# EAGLE design HASP_relay_V.2 (EAGLE 7.6.0)
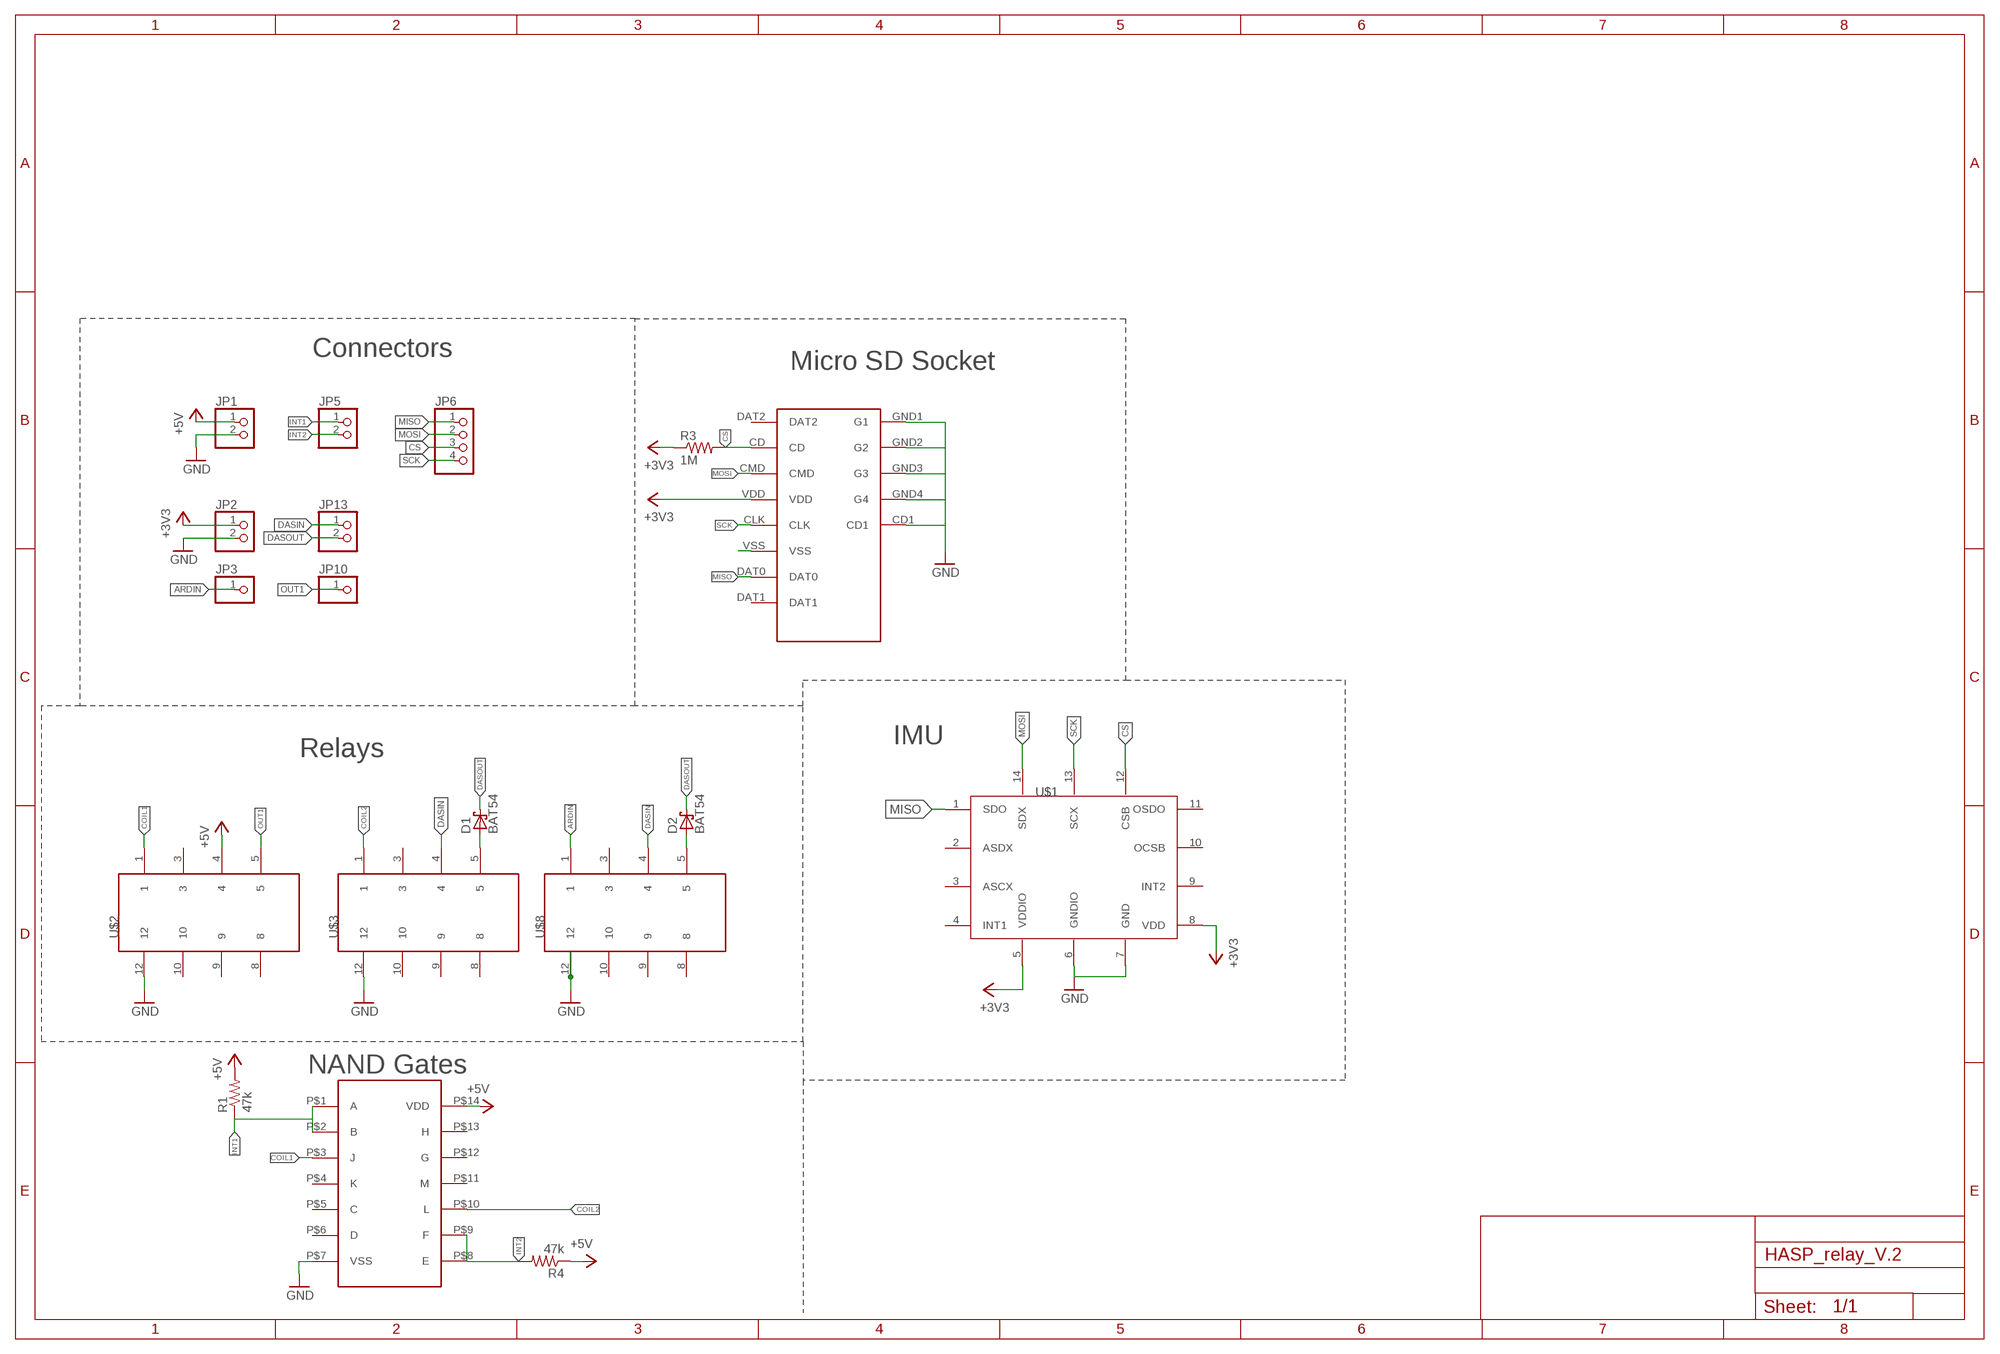
[diagram p0: schematic, sheet 1]

## Parts
D1  BAT54  [SOT23]
D2  BAT54  [SOT23]
JP1  PINHD-1X2  [1X02]
JP2  PINHD-1X2  [1X02]
JP3  PINHD-1X1  [1X01]
JP5  PINHD-1X2  [1X02]
JP6  PINHD-1X4  [1X04]
JP10  PINHD-1X1  [1X01]
JP13  PINHD-1X2  [1X02]
R1  47k  CRGS0603J1K5  [RESC1608X50N]
R3  1M  R-US_R0603  [R0603]
R4  47k  CRGS0603J1K5  [RESC1608X50N]
U$1  BMI160  [IMU]
U$2  EC2  [EC2-5SNU]
U$3  EC2  [EC2-5SNU]
U$4  MICRO_SD  [MICRO_SD_HINGED]
U$5  CD4093BE  [CD4093BE]
U$8  EC2  [EC2-5SNU]

## Nets
+3V3: JP2.1 R3.1 U$1.5(VDDIO) U$1.8(VDD) U$4.VDD
+5V: JP1.1 R1.2 R4.1 U$2.4 U$5.P$14(VDD)
ARDIN: JP3.1 U$8.1
COIL1: U$2.1 U$5.P$3(J)
COIL2: U$3.1 U$5.P$10(L)
CS: JP6.3 R3.2 U$1.12(CSB) U$4.CD
DASIN: JP13.1 U$3.4 U$8.4
DASOUT: D1.3(K) D2.3(K) JP13.2
GND: JP1.2 JP2.2 U$1.6(GNDIO) U$1.7(GND) U$2.12 U$3.12 U$4.CD1 U$4.GND1(G1) U$4.GND2(G2) U$4.GND3(G3) U$4.GND4(G4) U$5.P$7(VSS) U$8.12
INT1: JP5.1 U$5.P$1(A) U$5.P$2(B)
INT2: JP5.2 R4.2 U$5.P$8(E) U$5.P$9(F)
MISO: JP6.1 U$1.1(SDO) U$4.DAT0
MOSI: JP6.2 U$1.14(SDX) U$4.CMD
N$2: R1.1
N$3: D1.1(A) U$3.5
N$4: D2.1(A) U$8.5
N$5: U$4.VSS
OUT1: JP10.1 U$2.5
SCK: JP6.4 U$1.13(SCX) U$4.CLK
Unconnected: U$1.2(ASDX) U$1.3(ASCX) U$1.4(INT1) U$1.9(INT2) U$1.10(OCSB) U$1.11(OSDO) U$2.3 U$2.8 U$2.9 U$2.10 U$3.3 U$3.8 U$3.9 U$3.10 U$4.DAT1 U$4.DAT2 U$5.P$4(K) U$5.P$5(C) U$5.P$6(D) U$5.P$11(M) U$5.P$12(G) U$5.P$13(H) U$8.3 U$8.8 U$8.9 U$8.10

## Notes on the sheet
- Connectors
- Micro SD Socket
- IMU
- Relays
- NAND Gates

## Library data of the parts
D1 D2 = BAT54:BAT54: Schottky barrier diode Planar Schottky barrier diode encapsulated in small plastic SMD packages. Single diodes and double diodes with different pinning are available AAL Eindhoven MK; AVAILABILITY: Good; DESCRIPTION: Small Signal Schottky Diode, Single, 30 V, 200 mA, 800 mV, 600 mA, 150 C; MF: ON Semiconductor; MP: BAT54; PACKAGE: SOT-23-3 ON Semiconductor; PRICE: 0.08 USD
JP1 JP2 JP5 JP13 = pinhead:PINHD-1X2: PIN HEADER
JP3 JP10 = pinhead:PINHD-1X1: PIN HEADER
JP6 = pinhead:PINHD-1X4: PIN HEADER
R1 R4 = CRGS0603J1K5:CRGS0603J1K5: RESISTOR, THICK FILM, 1K5, 5%, 0603; AVAILABILITY: Good; DESCRIPTION: Resistor, Thick Film, 1k5, 5%, 0603; MF: TE Connectivity; MP: CRGS0603J1K5; PACKAGE: 0603 TE Connectivity / AMP; PRICE: 0.05 USD
R3 = resistor:R-US_: RESISTOR, American symbol
U$1 = IMU:BMI160
U$2 U$3 U$8 = relay board:EC2: EC2 is miniature signal relay Minimal board space is consumed with either a through-hole or surface mount configuration. Datasheet https://content.kemet.com/datasheets/KEM_R7002_EC2_EE2.pdf
U$4 = NR_connectors:MICRO_SD
U$5 = NAND Gates:CD4093BE: 4-Channel 2-Input 14-pin NAND Gates Datasheet: http://www.ti.com/lit/ds/symlink/cd4093b.pdf

## Board
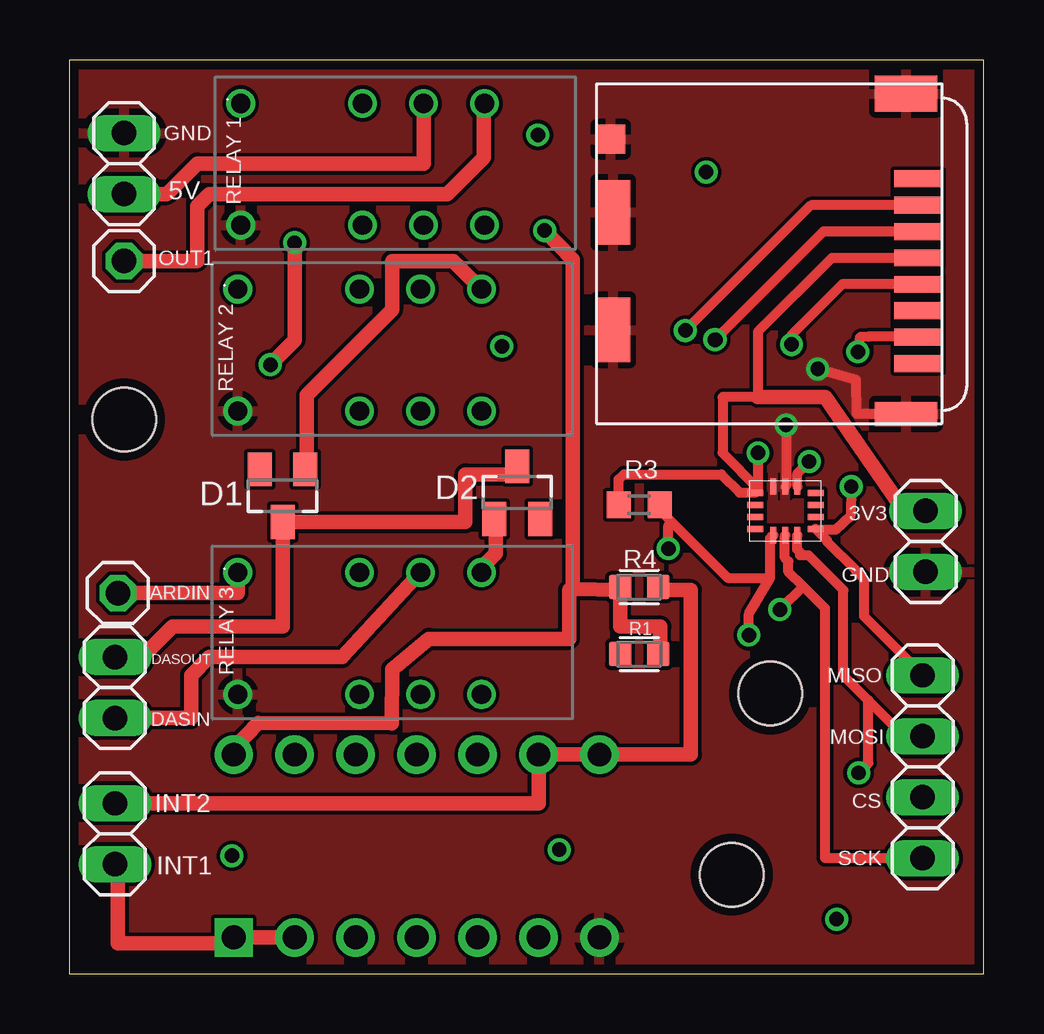
[diagram p1: board, top side]
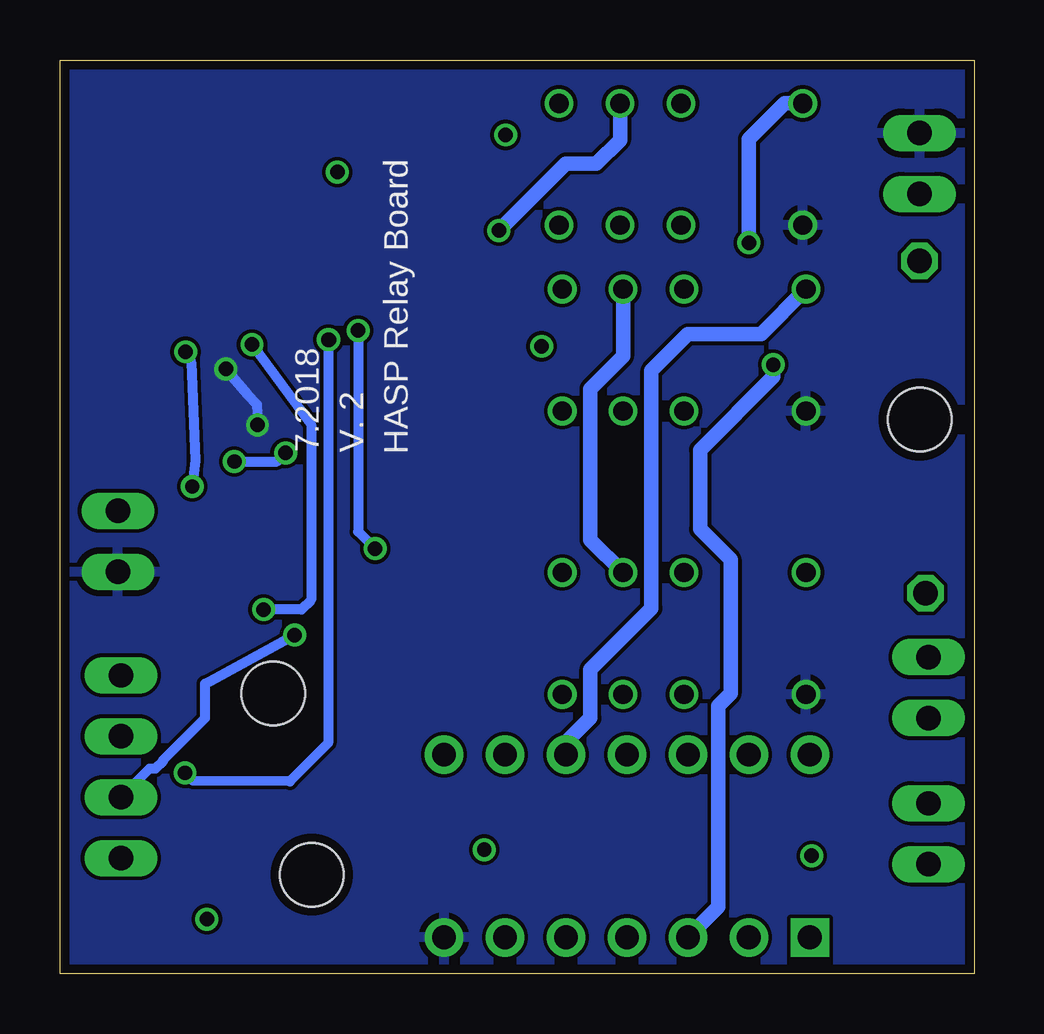
[diagram p2: board, bottom side, seen from below]

Size 38.1 x 38.1 mm. Coordinates in mm from the lower left corner, seen from the top.
Outline: 0,0 38.1,0 38.1,38.1 0,38.1 0,0
Copper layers (1*16): Top 0.0356mm / dielectric 1.5011mm / Bottom 0.0356mm
Design rules "OshPark": minimum track width 6mil, minimum drill 13mil, track to track 6mil, track to pad 6mil, pad to pad 6mil, via to via 6mil, smd to smd 6mil, copper to edge 15mil, drill to drill 6mil, minimum pad ring 7mil, minimum via ring 7mil, stop-mask expansion 3mil, vias tented up to drill 0mil, thermal gap 10mil
Holes 2.65 mm at 2.29,23.11 29.21,11.68 27.61,4.14

### Footprints (pad centres in the part's own frame; a part is rotated, then mirrored left to right if it is on the bottom)
SOT23 = smd 1 x 1.4: 1 -0.95,-1.1; 2 0.95,-1.1; 3 0,1.1
1X02 = drill 1.016 long: 1 -1.27,0; 2 1.27,0
1X01 = drill 1.016 octagon: 1 0,0
1X04 = drill 1.016 long: 1 -3.81,0; 2 -1.27,0; 3 1.27,0; 4 3.81,0
RESC1608X50N = smd 0.94 x 1.02: 1 -0.79,0; 2 0.79,0
R0603 = smd 1 x 1.1: 1 -0.85,0; 2 0.85,0
IMU = smd 0.675 x 0.25: 1 -1.262,0.75; 2 -1.262,0.25; 3 -1.262,-0.25; 4 -1.262,-0.75; 8 1.262,-0.75; 9 1.262,-0.25; 10 1.262,0.25; 11 1.262,0.75 | smd 0.25 x 0.675: 5 -0.5,-1.012; 6 0,-1.012; 7 0.5,-1.012; 12 0.5,1.012; 13 0,1.012; 14 -0.5,1.012
EC2-5SNU = drill 0.8: 1 1.05,6.19; 3 6.13,6.19; 4 8.67,6.19; 5 11.21,6.19; 8 11.21,1.11; 9 8.67,1.11; 10 6.13,1.11; 12 1.05,1.11
MICRO_SD_HINGED = smd 0.7 x 2: CD -1.1,-13.4; CLK -4.4,-13.4; CMD -2.2,-13.4; DAT0 -6.6,-13.4; DAT1 -7.7,-13.4; DAT2 0,-13.4; VDD -3.3,-13.4; VSS -5.5,-13.4 | smd 2.7 x 1.4: CD1 -1.4,-0.7; GND3 -6.3,-0.7 | smd 1.5 x 2.6: GND1 3.55,-12.9 | smd 1.2 x 1.2: GND2 1.65,-0.6 | smd 1 x 2.6: GND4 -9.8,-12.9
CD4093BE = drill 0.991 pad 1.6 square: P$1 -3.81,7.62 | drill 0.991 pad 1.6: P$2 -3.81,5.08; P$3 -3.81,2.54; P$4 -3.81,0; P$5 -3.81,-2.54; P$6 -3.81,-5.08; P$7 -3.81,-7.62; P$8 3.81,-7.62; P$9 3.81,-5.08; P$10 3.81,-2.54; P$11 3.81,0; P$12 3.81,2.54; P$13 3.81,5.08; P$14 3.81,7.62

### Placement (x,y rotation side)
D1  8.89,19.94 180 top
D2  18.67,20.07 0 top
JP1  2.29,33.78 90 top
JP2  35.69,18.03 270 top
JP3  2.03,15.88 0 top
JP5  1.91,5.84 90 top
JP6  35.56,8.64 270 top
JP10  2.29,29.72 0 top
JP13  1.91,11.94 90 top
R1  23.75,13.34 0 top
R3  23.75,19.56 0 top
R4  23.75,16.13 0 top
U$1  29.84,19.3 180 top
U$2  6.1,30.1 0 top
U$3  5.97,22.35 0 top
U$4  21.97,33.15 90 top
U$5  14.48,5.33 90 top
U$8  5.97,10.54 0 top

### Tracks (layer width: path | path; a pad name or v marks a point on that pad's centre or on a via)
+3V3  (via drill 0.6)
  Top 0.406: R3.1 22.9,20.61 23.11,20.83 27.18,20.83 27.94,20.07 28.57,20.07 U$1.8 28.7,20.17 28.7,20.24 | 28.7,20.24 27.23,21.72 27.23,24.03 27.25,24.05 28.7,24.05 28.7,26.77 31.77,29.84 U$4.VDD | U$1.5 30.34,20.87 v30.84,21.36 | v28.7,21.72 28.7,20.24
  Top 0.61: JP2.1 34.8,19.3 31.5,24.05 28.7,24.05
  Bottom 0.406: v30.84,21.36 29.06,21.36 v28.7,21.72
+5V  (via drill 0.6)
  Top 0.61: R1.2 24.64,13.34 24.64,14.48 22.96,14.48 R4.1 22.96,16 20.98,16.05 | JP1.1 4.06,32.51 5.33,33.78 14.77,33.78 U$2.4 | U$5.P$14 6.86,9.4 7.87,10.46 13.44,10.44 13.46,12.7 14.99,13.97 20.83,13.97 20.83,16 20.98,16.05 | v19.81,30.99 20.98,29.77 20.98,16.05
  Bottom 0.61: U$2.4 14.77,34.76 15.75,33.78 17.02,33.78 v19.81,30.99
ARDIN
  Top 0.61: JP3.1 7.02,15.88 U$8.1
COIL1  (via drill 0.6)
  Top 0.61: v9.4,30.48 9.4,26.42 v8.38,25.4
  Bottom 0.61: U$2.1 7.91,36.29 9.4,34.8 v9.4,30.48 | v8.38,25.4 8.38,24.89 11.43,21.84 11.43,18.54 10.16,17.27 10.16,11.68 10.67,11.18 10.67,2.79 U$5.P$3
COIL2
  Bottom 0.61: U$5.P$10 17.02,9.65 16,10.67 16,12.7 13.46,15.24 13.46,25.15 11.94,26.67 8.89,26.67 U$3.1
CS  (via drill 0.6)
  Top 0.406: R3.2 24.6,19.34 25.11,18.83 | 25.11,18.83 27.43,16.51 29.21,16.51 | 29.21,16.51 29.21,18.16 U$1.12 | U$4.CD 30.9,32.05 v25.68,26.82 | v24.97,17.73 24.97,18.69 25.11,18.83 | v28.32,14.12 28.32,15.01 29.21,16.51
  Bottom 0.406: v25.68,26.82 25.68,18.44 v24.97,17.73 | JP6.3 34.37,8.56 34.11,8.56 33.81,8.87 33.81,8.91 32.05,10.67 32.05,12.09 v28.32,14.12
DASIN
  Top 0.61: JP13.1 5.08,10.67 5.08,12.45 5.84,13.21 11.37,13.21 U$8.4
  Bottom 0.61: U$3.4 14.64,25.75 16,24.38 16,18.09 U$8.4
DASOUT
  Top 0.61: JP13.2 3.05,13.21 4.32,14.48 8.89,14.48 D1.3 16.51,18.84 16.51,20.83 18.67,20.83 D2.3
GND  (via drill 0.6)
  Top 0.406: U$4.GND4 32.81,23.35 32.79,24.77 v31.19,25.22 | v29.87,22.89 29.87,20.34 U$1.6
  Bottom 0.406: v31.19,25.22 30.3,24.18 29.9,23.75 v29.87,22.89
  pour Top: 0,38.35 38.61,38.35 38.61,-0.25 0,-0.25
  pour Bottom: -0.25,38.35 38.61,38.35 38.61,-0.25 -0.25,-0.25
INT1
  Top 0.61: JP5.1 2.03,4.57 2.03,1.27 6.86,1.27 U$5.P$1 U$5.P$2
INT2
  Top 0.61: JP5.2 19.56,7.11 U$5.P$9 U$5.P$8 25.91,9.14 25.91,16 24.54,16 R4.2
MISO  (via drill 0.6)
  Top 0.406: JP6.1 35.56,12.47 33.12,14.91 33.12,16.46 32.79,16.79 32.79,16.82 31.57,18.03 31.57,18.09 U$1.1 31.14,18.52 31.93,18.52 32.56,19.1 v32.59,20.32 | U$4.DAT0 35.35,26.57 33.3,26.57 32.94,26.54 v32.87,25.93
  Bottom 0.406: v32.87,25.93 32.64,25.5 32.46,21.41 v32.59,20.32
MOSI  (via drill 0.6)
  Top 0.406: JP6.2 34.8,9.91 33.3,11.4 | 33.3,11.4 32.26,12.45 32.26,16 30.81,17.45 30.45,17.45 30.45,17.58 30.33,17.7 30.33,18.27 U$1.14 | U$4.CMD 31.43,30.95 v26.92,26.44 | v32.89,8.38 33.3,8.79 33.3,11.4
  Bottom 0.406: v26.92,26.44 26.92,9.63 28.52,8.03 32.56,8.05 v32.89,8.38
N$3
  Top 0.61: U$3.5 16,29.72 13.46,29.72 13.46,27.69 9.91,24.13 9.91,21.11 D1.1
N$4
  Top 0.61: U$8.5 17.18,16.93 17.78,17.53 17.78,18.91 D2.1
N$6  (via drill 0.6)
  other vias: 26.9,26.44
N$8  (via drill 0.6)
  other vias: 31.98,2.29
N$9  (via drill 0.6)
  other vias: 26.54,33.43
N$10  (via drill 0.6)
  other vias: 18.03,26.16
N$11  (via drill 0.6)
  other vias: 19.53,34.98
N$12  (via drill 0.6)
  other vias: 6.78,4.93
N$13  (via drill 0.6)
  other vias: 20.42,5.18
OUT1
  Top 0.61: JP10.1 5.33,29.72 5.33,32 5.84,32.51 15.75,32.51 17.27,34.04 17.27,36.26 U$2.5
SCK  (via drill 0.6)
  Top 0.406: JP6.4 31.5,4.83 31.5,15.24 30.58,16.15 | 30.58,16.15 29.97,16.76 29.97,17.2 29.82,17.35 29.82,18.27 U$1.13 | U$4.CLK 32.21,28.75 30.12,26.67 v30.1,26.24 | 30.58,16.15 v29.62,15.19
  Bottom 0.406: v30.1,26.24 27.64,22.91 27.64,15.6 28.04,15.19 v29.62,15.19

### Text on the board
tPlace: GND | 5V | RELAY 1 | OUT1 | RELAY 2 | 3V3 | ARDIN | GND | DASOUT | RELAY 3 | MISO | DASIN | MOSI | INT2 | CS | SCK | INT1
bPlace: HASP Relay Board | V. 2 | 7.2018